# Altium schematic sheet Sheet1.SchDoc
size A2
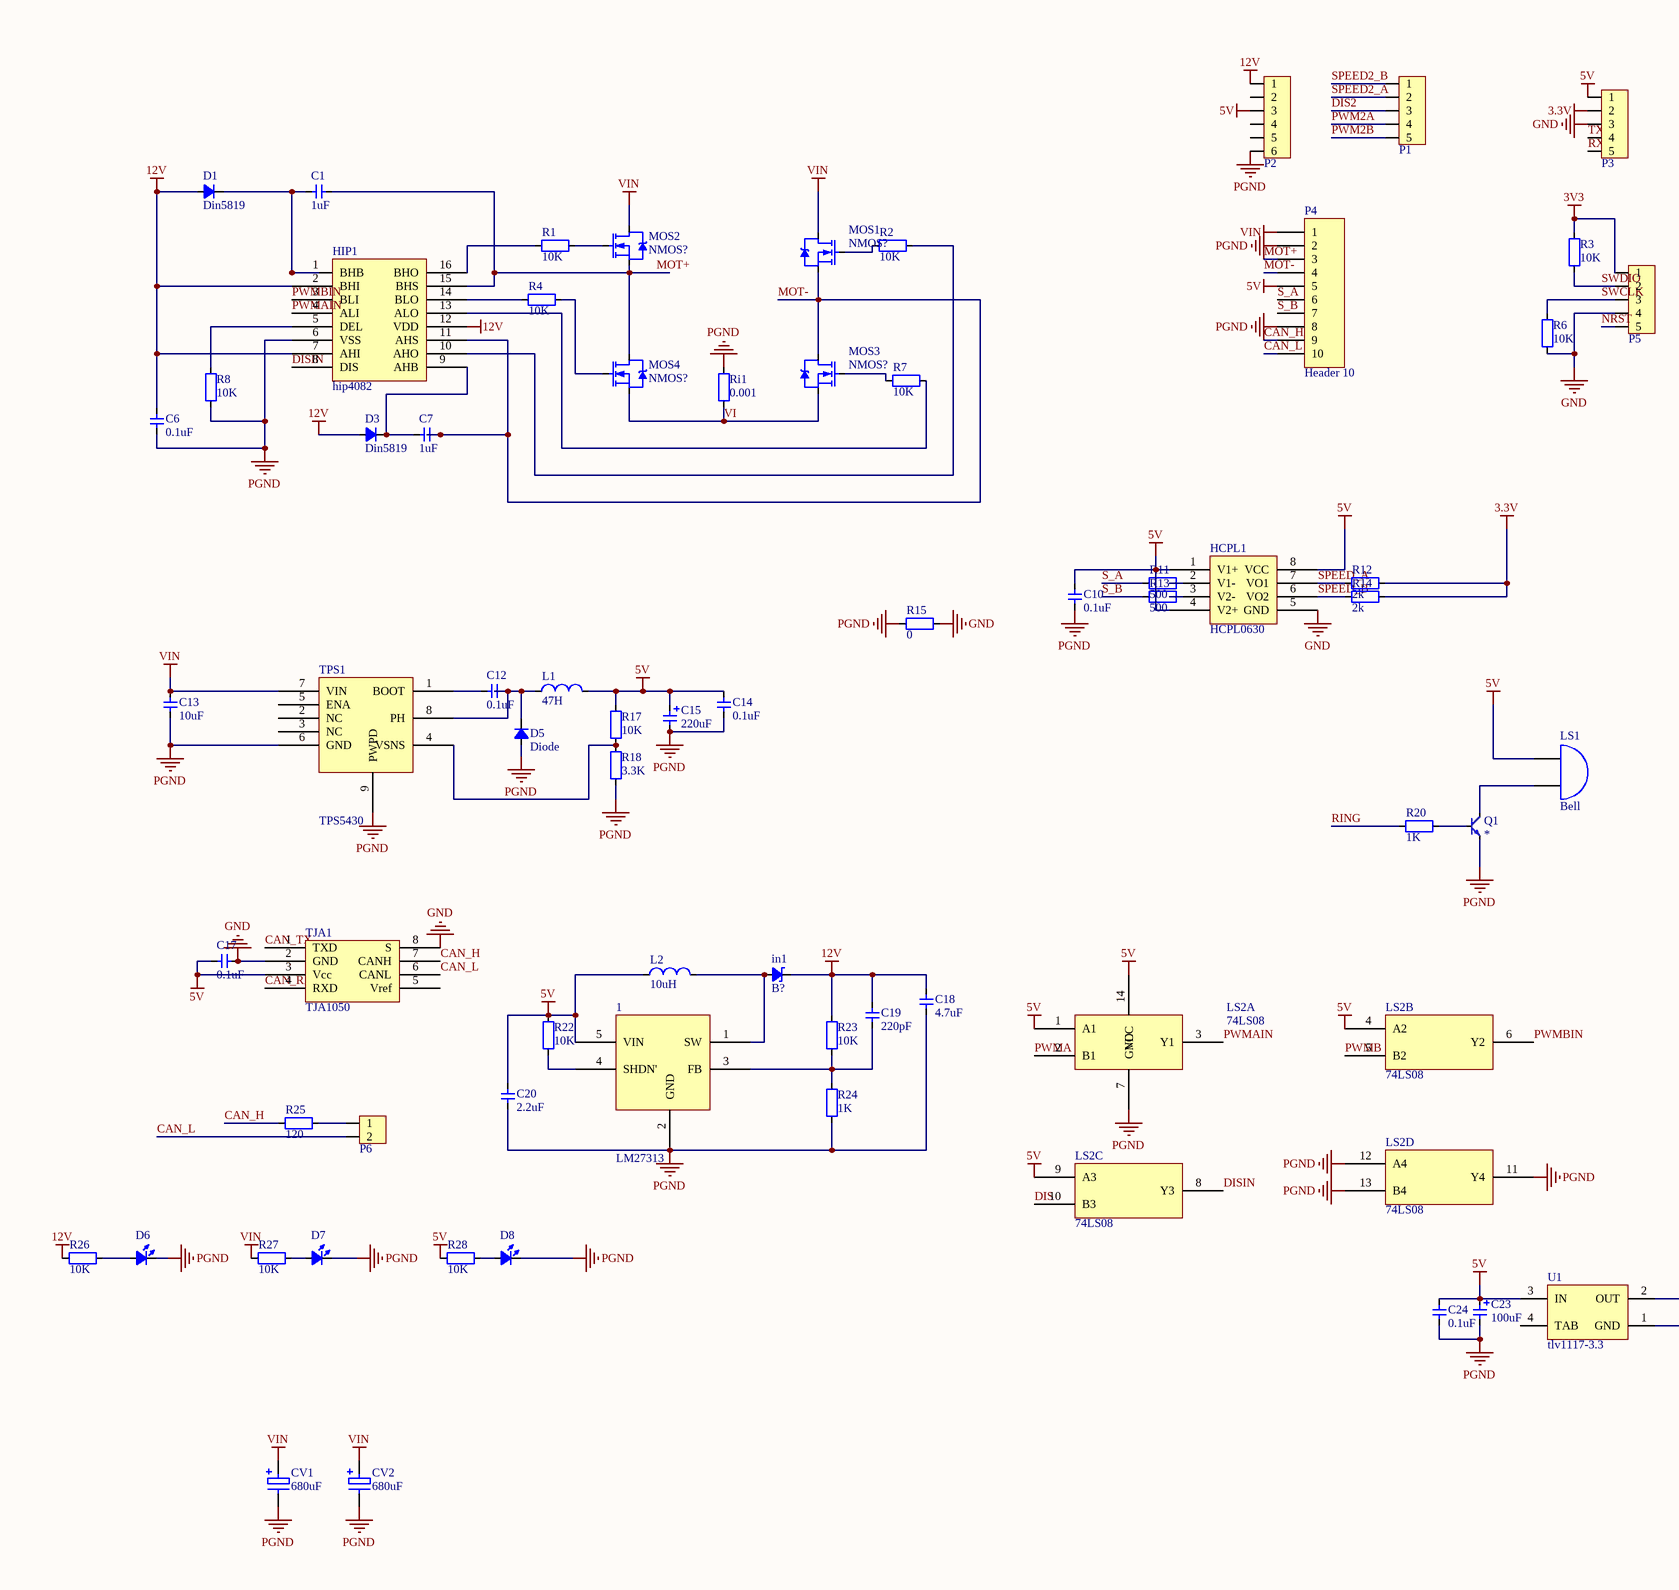
[diagram p0: Sheet1.SchDoc, left]
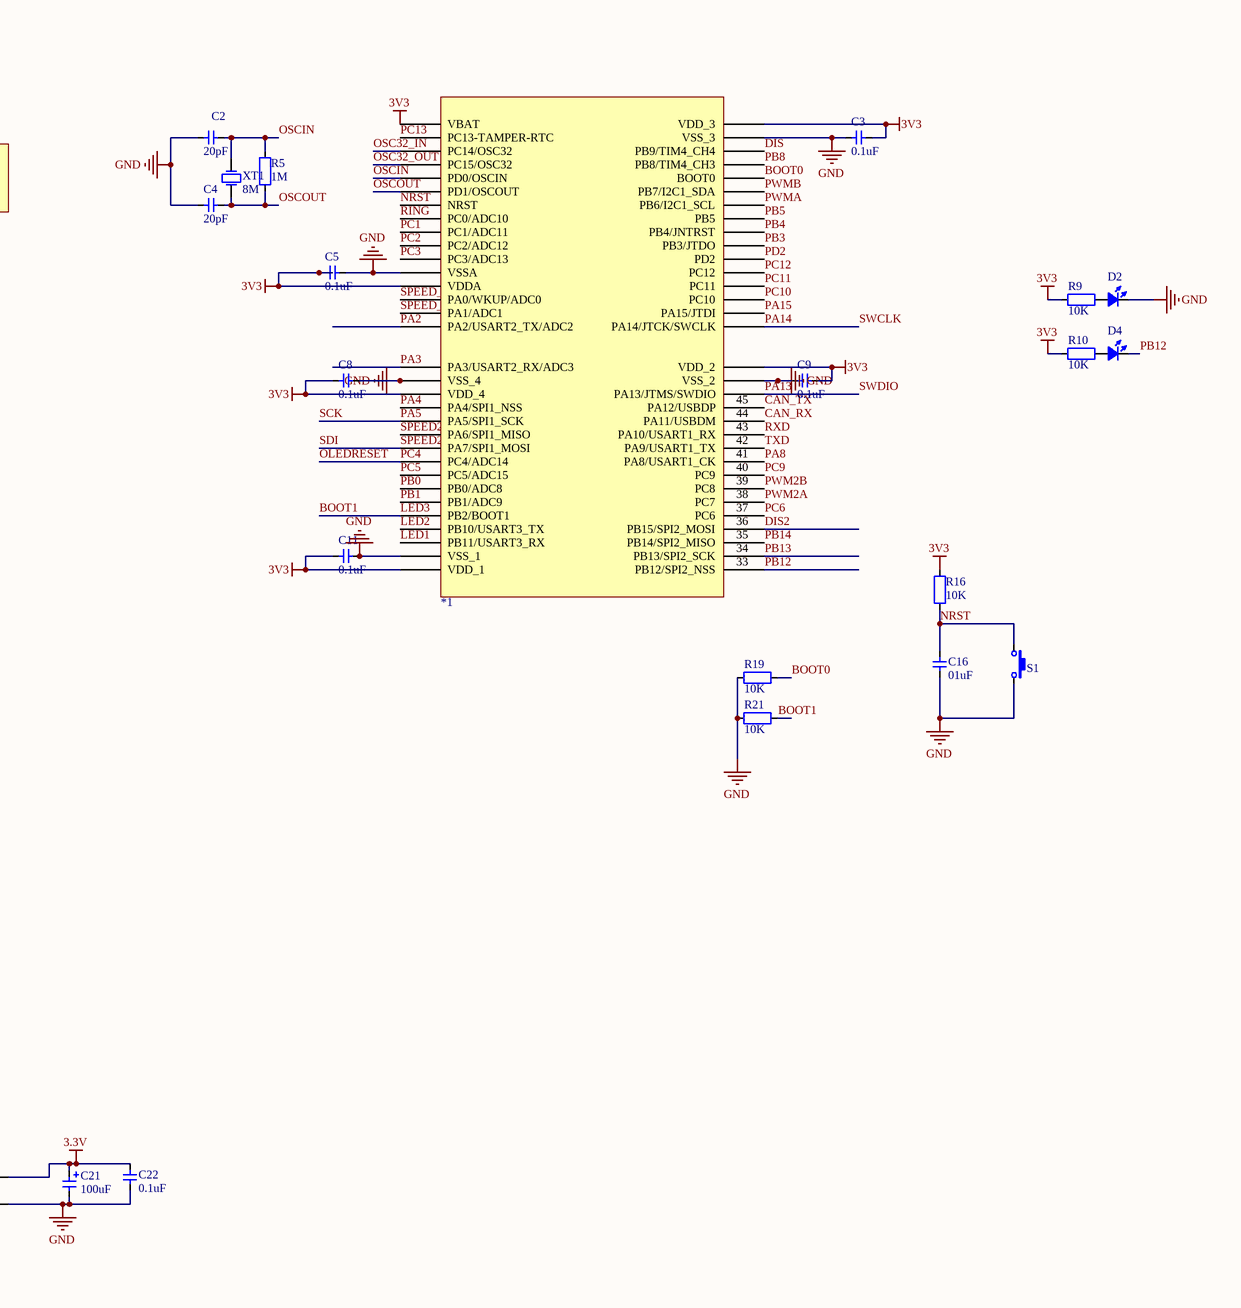
[diagram p1: Sheet1.SchDoc, right]

## Parts
1  LM27313  [SOT23-5]
*1  STM32F103RC  [LQFP_P0.5_64]  (value not drawn)
C1  value 1uF  [CAP_0603]  (hidden comment: Cap_0603)
C2  value 20pF  [CAP_0603]  (hidden comment: Cap_0603)
C3  value 0.1uF  [CAP_0603]  (hidden comment: Cap_0603)
C4  value 20pF  [CAP_0603]  (hidden comment: Cap_0603)
C5  value 0.1uF  [CAP_0603]  (hidden comment: Cap_0603)
C6  value 0.1uF  [CAP_0603]  (hidden comment: Cap_0603)
C7  value 1uF  [CAP_0603]  (hidden comment: Cap_0603)
C8  value 0.1uF  [CAP_0603]  (hidden comment: Cap_0603)
C9  value 0.1uF  [CAP_0603]  (hidden comment: Cap_0603)
C10  value 0.1uF  [CAP_0603]  (hidden comment: Cap_0603)
C11  value 0.1uF  [CAP_0603]  (hidden comment: Cap_0603)
C12  value 0.1uF  [CAP_0603]  (hidden comment: Cap_0603)
C13  value 10uF  [CAP_0603]  (hidden comment: Cap_0603)
C14  value 0.1uF  [CAP_0603]  (hidden comment: Cap_0603)
C15  value 220uF  [CAP_TAN_P0805]  (hidden comment: Cap_Tan_0805)
C16  value 01uF  [CAP_0603]  (hidden comment: Cap_0603)
C17  value 0.1uF  [CAP_0603]  (hidden comment: Cap_0603)
C18  value 4.7uF  [CAP_0603]  (hidden comment: Cap_0603)
C19  value 220pF  [CAP_0603]  (hidden comment: Cap_0603)
C20  value 2.2uF  [CAP_0603]  (hidden comment: Cap_0603)
C21  value 100uF  [CAP_TAN_P0805]  (hidden comment: Cap_Tan_0805)
C22  value 0.1uF  [CAP_0603]  (hidden comment: Cap_0603)
C23  value 100uF  [CAP_TAN_P0805]  (hidden comment: Cap_Tan_0805)
C24  value 0.1uF  [CAP_0603]  (hidden comment: Cap_0603)
CV1  680uF  [电解电容器]
CV2  680uF  [电解电容器]
D1  Din5819  [LED_0805_RED]
D2  LED_0805  [LED_0805_RED]  (value not drawn)
D3  Din5819  [LED_0805_RED]
D4  LED_0805  [LED_0805_RED]  (value not drawn)
D5  Diode  [LED_0805_RED]
D6  LED_0603  [LED_0603_RED]  (value not drawn)
D7  LED_0603  [LED_0603_RED]  (value not drawn)
D8  LED_0603  [LED_0603_RED]  (value not drawn)
HCPL1  HCPL0630  [SOP_E150_8]
HIP1  hip4082  [SOP_E150_16]
in1  value B?  [SOD-123]  (hidden comment: SchottkyDiode_SOD123)
L1  value 47H  [IND_0603]  (hidden comment: Ind_0603)
L2  value 10uH  [IND_0603]  (hidden comment: Ind_0603)
LS1  Bell  [Bell-5.6-0.6-9mm]
LS2  74LS08  [SOP14]  (parts A,B,C,D of 4)
MOS1  value NMOS?  [TO-252AA]  (hidden comment: MOSFET_N)
MOS2  value NMOS?  [TO-252AA]  (hidden comment: MOSFET_N)
MOS3  value NMOS?  [TO-252AA]  (hidden comment: MOSFET_N)
MOS4  value NMOS?  [TO-252AA]  (hidden comment: MOSFET_N)
P1  HDR1x5_2.54  [HDR1X5_2.54_180]  (value not drawn)
P2  HDR1x6_2.54  [HDR1X6_2.54_180]  (value not drawn)
P3  HDR1x5_2.54  [Green_5P]  (value not drawn)
P4  Header 10  [Green_10P]
P5  HDR1x5_2.54  [HDR1X5_2.54_180]  (value not drawn)
P6  HDR1x2_2.54  [HDR1X2_2.54_180]  (value not drawn)
Q1  BJT_NPN  [SOT23-3]  (value not drawn)
R1  value 10K  [RES_0603]  (hidden comment: Res_0603)
R2  value 10K  [RES_0603]  (hidden comment: Res_0603)
R3  value 10K  [RES_0603]  (hidden comment: Res_0603)
R4  value 10K  [RES_0603]  (hidden comment: Res_0603)
R5  value 1M  [RES_0603]  (hidden comment: Res_0603)
R6  value 10K  [RES_0603]  (hidden comment: Res_0603)
R7  value 10K  [RES_0603]  (hidden comment: Res_0603)
R8  value 10K  [RES_0603]  (hidden comment: Res_0603)
R9  value 10K  [RES_0603]  (hidden comment: Res_0603)
R10  value 10K  [RES_0603]  (hidden comment: Res_0603)
R11  value 500  [RES_0603]  (hidden comment: Res_0603)
R12  value 2k  [RES_0603]  (hidden comment: Res_0603)
R13  value 500  [RES_0603]  (hidden comment: Res_0603)
R14  value 2k  [RES_0603]  (hidden comment: Res_0603)
R15  value 0  [RES_0603]  (hidden comment: Res_0603)
R16  value 10K  [RES_0603]  (hidden comment: Res_0603)
R17  value 10K  [RES_0603]  (hidden comment: Res_0603)
R18  value 3.3K  [RES_0603]  (hidden comment: Res_0603)
R19  value 10K  [RES_0603]  (hidden comment: Res_0603)
R20  value 1K  [RES_0603]  (hidden comment: Res_0603)
R21  value 10K  [RES_0603]  (hidden comment: Res_0603)
R22  value 10K  [RES_0603]  (hidden comment: Res_0603)
R23  value 10K  [RES_0603]  (hidden comment: Res_0603)
R24  value 1K  [RES_0603]  (hidden comment: Res_0603)
R25  value 120  [RES_0603]  (hidden comment: Res_0603)
R26  value 10K  [RES_0603]  (hidden comment: Res_0603)
R27  value 10K  [RES_0603]  (hidden comment: Res_0603)
R28  value 10K  [RES_0603]  (hidden comment: Res_0603)
Ri1  value 0.001  [RES_0603]  (hidden comment: Res_0603)
S1  ButtonTACT_3x6x2.5_180  [ButtonTACT_3x6x2.5_180]  (value not drawn)
TJA1  TJA1050  [SOP_E150_8]
TPS1  TPS5430  [SOP_E150_9]
U1  tlv1117-3.3  [SOT223-3]
XT1  value 8M  [XT_5032_2]  (hidden comment: XTAL_32.768kHz)

## Nets
3.3V: C21.1 C22.2 P3.2 R12.1 R14.1 U1.2(OUT)
3V3: *1.1(VBAT) *1.13(VDDA) *1.19(VDD_4) *1.32(VDD_1) *1.48(VDD_2) *1.64(VDD_3) C3.2 C5.1 C8.1 C9.2 C11.1 P5.1 R3.2 R9.1 R10.1 R16.2
5V: 1.5(VIN) C10.2 C14.2 C15.1 C17.2 C20.2 C23.1 C24.2 HCPL1.1(V1+) HCPL1.4(V2+) HCPL1.8(VCC) L1.2 L2.1 LS1.1(A) LS2.1(A1) LS2.4(A2) LS2.9(A3) LS2.14(VCC) P2.3 P3.1 P4.5 R17.2 R22.2 R28.1 TJA1.3(Vcc) U1.3(IN)
12V: C6.2 C18.2 C19.2 D1.1(A) D3.1(A) HIP1.2(BHI) HIP1.7(AHI) HIP1.12(VDD) in1.2(K) P2.1 R23.2 R26.1
GND: *1.12(VSSA) *1.18(VSS_4) *1.31(VSS_1) *1.47(VSS_2) *1.63(VSS_3) C2.1 C3.1 C4.1 C5.2 C8.2 C9.1 C11.2 C16.1 C17.1 C21.2 C22.1 D2.2(K) HCPL1.5(GND) P3.3 P5.4 R6.1 R15.2 R19.2 R21.2 S1.2 TJA1.2(GND) TJA1.8(S) U1.1(GND)
PGND: 1.2(GND) C6.1 C10.1 C13.1 C14.1 C15.2 C18.1 C20.1 C23.2 C24.1 CV1.2 CV2.2 D5.1(A) D6.2(K) D7.2(K) D8.2(K) HIP1.6(VSS) LS2.7(GND) LS2.11(Y4) LS2.12(A4) LS2.13(B4) P2.6 P4.2 P4.8 Q1.2(E) R8.1 R15.1 R18.1 R24.1 Ri1.2 TPS1.6(GND) TPS1.9(PWPD)
VIN: C13.2 CV1.1 CV2.1 MOS1.4(D) MOS2.4(D) P4.1 R27.1 TPS1.7(VIN)
BOOT0: *1.60(BOOT0) R19.1
BOOT1: *1.28(PB2/BOOT1) R21.1  [also labelled LED3]
CAN_H: P4.9 R25.1 TJA1.7(CANH)
CAN_L: P4.10 P6.2 TJA1.6(CANL)
CAN_RX: *1.44(PA11/USBDM) TJA1.4(RXD)
CAN_TX: *1.45(PA12/USBDP) TJA1.1(TXD)
DIS: *1.62(PB9/TIM4_CH4) LS2.10(B3)
DIS2: *1.36(PB15/SPI2_MOSI) P1.3
DISIN: HIP1.8(DIS) LS2.8(Y3)
LED1: *1.30(PB11/USART3_RX)
LED2: *1.29(PB10/USART3_TX)
MOT+: C1.2 HIP1.15(BHS) MOS2.3(S) MOS4.4(D) P4.3
MOT-: C7.2 HIP1.11(AHS) MOS1.3(S) MOS3.4(D) P4.4
NRST: *1.7(NRST) C16.2 P5.5 R16.1 S1.1
OLEDRESET: *1.24(PC4/ADC14)  [also labelled PC4]
OSC32_IN: *1.3(PC14/OSC32)
OSC32_OUT: *1.4(PC15/OSC32)
OSCIN: *1.5(PD0/OSCIN) C2.2 R5.2 XT1.2(OSC2)
OSCOUT: *1.6(PD1/OSCOUT) C4.2 R5.1 XT1.1(OSC1)
PA2: *1.16(PA2/USART2_TX/ADC2)
PA3: *1.17(PA3/USART2_RX/ADC3)
PA4: *1.20(PA4/SPI1_NSS)
PA5: *1.21(PA5/SPI1_SCK)  [also labelled SCK]
PA8: *1.41(PA8/USART1_CK)
PA13: *1.46(PA13/JTMS/SWDIO) P5.2 R3.1  [also labelled SWDIO]
PA14: *1.49(PA14/JTCK/SWCLK) P5.3 R6.2  [also labelled SWCLK]
PA15: *1.50(PA15/JTDI)
PB0: *1.26(PB0/ADC8)
PB1: *1.27(PB1/ADC9)
PB3: *1.55(PB3/JTDO)
PB4: *1.56(PB4/JNTRST)
PB5: *1.57(PB5)
PB8: *1.61(PB8/TIM4_CH3)
PB12: *1.33(PB12/SPI2_NSS) D4.2(K)
PB13: *1.34(PB13/SPI2_SCK)
PB14: *1.35(PB14/SPI2_MISO)
PC1: *1.9(PC1/ADC11)
PC2: *1.10(PC2/ADC12)
PC3: *1.11(PC3/ADC13)
PC5: *1.25(PC5/ADC15)
PC6: *1.37(PC6)
PC9: *1.40(PC9)
PC10: *1.51(PC10)
PC11: *1.52(PC11)
PC12: *1.53(PC12)
PC13: *1.2(PC13-TAMPER-RTC)
PD2: *1.54(PD2)
PWM2A: *1.38(PC7) P1.4
PWM2B: *1.39(PC8) P1.5
PWMA: *1.58(PB6/I2C1_SCL) LS2.2(B1)
PWMAIN: HIP1.4(ALI) LS2.3(Y1)
PWMB: *1.59(PB7/I2C1_SDA) LS2.5(B2)
PWMBIN: HIP1.3(BLI) LS2.6(Y2)
RING: *1.8(PC0/ADC10) R20.1
RXD: *1.43(PA10/USART1_RX) P3.5
S_A: P4.6 R11.2
S_B: P4.7 R13.2
SDI: *1.23(PA7/SPI1_MOSI) P1.1  [also labelled SPEED2_B]
SPEED2_A: *1.22(PA6/SPI1_MISO) P1.2
SPEED_A: *1.14(PA0/WKUP/ADC0) HCPL1.7(VO1) R12.2
SPEED_B: *1.15(PA1/ADC1) HCPL1.6(VO2) R14.2
TXD: *1.42(PA9/USART1_TX) P3.4
VI: MOS3.3(S) MOS4.3(S) Ri1.1
Net1_1: 1.1(SW) in1.1(A) L2.2
Net1_3: 1.3(FB) C19.1 R23.1 R24.2
Net1_4: 1.4(SHDN') R22.1
NetC1_1: C1.1 D1.2(K) HIP1.1(BHB)
NetC7_1: C7.1 D3.2(K) HIP1.9(AHB)
NetC12_1: C12.1 TPS1.1(BOOT)
NetC12_2: C12.2 D5.2(K) L1.1 TPS1.8(PH)
NetD2_1: D2.1(A) R9.2
NetD4_1: D4.1(A) R10.2
NetD6_1: D6.1(A) R26.2
NetD7_1: D7.1(A) R27.2
NetD8_1: D8.1(A) R28.2
NetHCPL1_2: HCPL1.2(V1-) R11.1
NetHCPL1_3: HCPL1.3(V2-) R13.1
NetHIP1_5: HIP1.5(DEL) R8.2
NetHIP1_10: HIP1.10(AHO) R2.2
NetHIP1_13: HIP1.13(ALO) R7.2
NetHIP1_14: HIP1.14(BLO) R4.1
NetHIP1_16: HIP1.16(BHO) R1.1
NetLS1_2: LS1.2(B) Q1.3(C)
NetMOS1_1: MOS1.1(G) R2.1
NetMOS2_1: MOS2.1(G) R1.2
NetMOS3_1: MOS3.1(G) R7.1
NetMOS4_1: MOS4.1(G) R4.2
NetP6_1: P6.1 R25.2
NetQ1_1: Q1.1(B) R20.2
NetR17_1: R17.1 R18.2 TPS1.4(VSNS)

Not connected (* = marked no-connect by the designer): P2 2 4 5; TJA1 5(Vref); TPS1 2(NC) 3(NC) 5(ENA); U1 4(TAB)

## Library data of the parts
*1 = STM32F103RC: MCU
C1-C14 C16-C20 C22 C24 = Cap_0603: Capacitor
C15 C21 C23 = Cap_Tan_0805: Capacitor
CV1 CV2 = CAP-ELE: 电解电容; Value: *μF; Published: 8-Jun-2000; LatestRevisionDate: 17-Jul-2002; LatestRevisionNote: Re-released for DXP Platform.; PackageReference: RB7.6-15; Publisher: Altium Limited; PackageDescription: Polarized Capacitor (Radial); 2 Leads
D1 D3 = Diode
D2 D4 = LED_0805: LED
D6-D8 = LED_0603: LED
in1 = SchottkyDiode_SOD123: Diode
L1 L2 = Ind_0603: Inductor
LS1 = Bell: Electrical Bell; Published: 24-Mar-1999; LatestRevisionDate: 17-Jul-2002; LatestRevisionNote: Re-released for DXP Platform.; PackageReference: PIN2; Publisher: Altium Limited
MOS1-MOS4 = MOSFET_N: MOSFET
P1 P3 P5 = HDR1x5_2.54: Header
P2 = HDR1x6_2.54: Header
P4 = Header 10: Header, 10-Pin; LatestRevisionDate: 17-Jul-2002; LatestRevisionNote: Re-released for DXP Platform.; Publisher: Altium Limited
P6 = HDR1x2_2.54: Header
Q1 = BJT_NPN: Transistor; Value: *
R1-R28 Ri1 = Res_0603: Resistor
S1 = ButtonTACT_3x6x2.5_180: Button
TJA1 = TJA1050: CAN总线收发器
U1 = LM1117IMP-5.0: 800mA Low-Dropout Linear Regulator; Manufacturer: National Semiconductor; CompType: LDO IC; PackageTopMarking: XYTT*N06B; PowerWise: N; Published: 4-Dec-2008; DatasheetVersion: Apr-2006; PackageVersion: revB, Apr-2003; PackageReference: MP04A; Publisher: Altium Limited; PackageDescription: Molded SOT-223, 6.50 x 3.56 x 1.6mm Body, 4 Lead, 2.3mm Pitch; PartNumber: LM1117IMP-5.0; RoHS: O; PinCount: 4; DigiKeyPartNumber: LM1117IMP-5.0CT-ND; Code_JEDEC: TO-261-AA; Code_IPC: SOT223-4; ComponentLink1Description: LM1117 Datasheet; ComponentLink1URL: http://www.national.com/ds/LM/LM1117.pdf; ComponentLink2Description: LM1117 Web Page; ComponentLink2URL: http://www.national.com/pf/LM/LM1117.html; ComponentLink3Description: MP04A Package Page; ComponentLink3URL: http://www.national.com/packaging/folders/mp04a.html
XT1 = XTAL_32.768k: Crystal Oscillator